# Altium project CMTestBoard.PrjPcb (part 1 of 2)
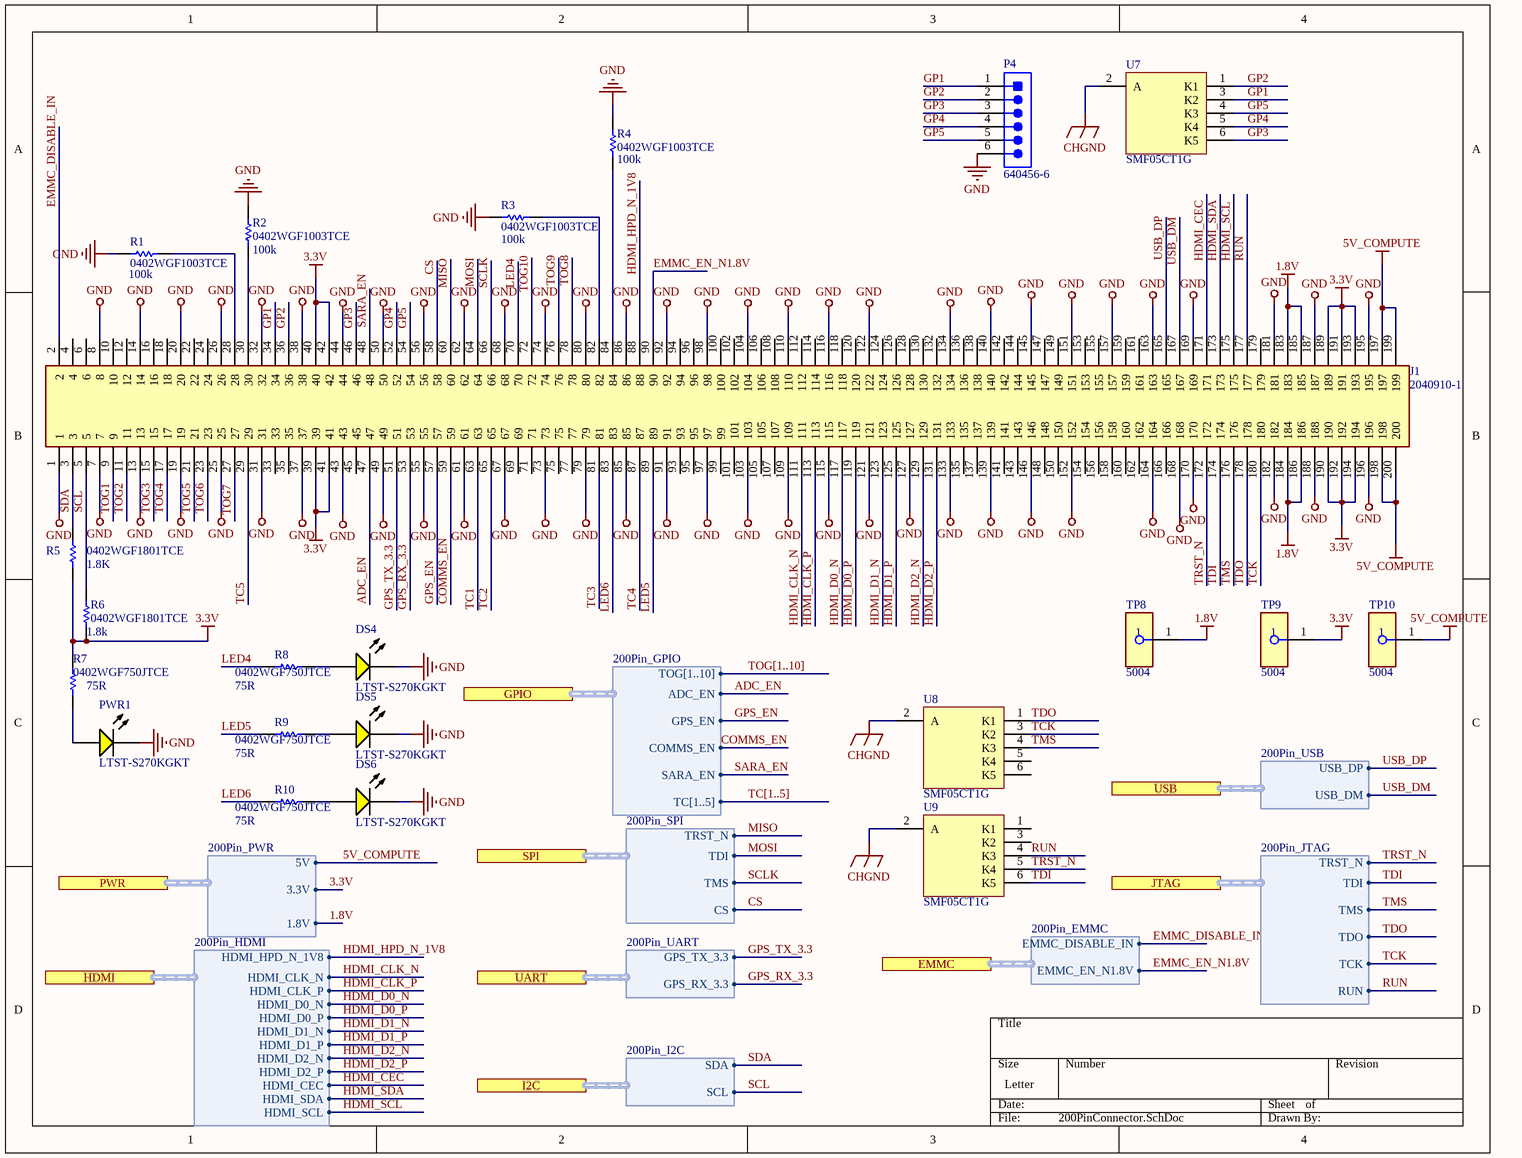
[diagram p0: 200PinConnector.SchDoc]
8 sheets, 181 parts. Net scope: hierarchical (ports join the sheet entries above them; power ports are global).
Board files: CMTestBoard.PcbDoc, CMTestBoardV2.PcbDoc
Sheets:
  200PinConnector.SchDoc
  CMTopLevel.SchDoc
    U_CMPower = 1_CMPower.SchDoc
    U_Peripherals = 4_PeripheralsV2.SchDoc
    U_200PinConnector = 3_JetsonDRAMConnector.SchDoc
    U_STM32F4 = 2_STM32F4.SchDoc
  XC95144XL.SchDoc
  EPM240T100C5N.SchDoc

## Sheet 200PinConnector.SchDoc
size Letter

### Parts
(Parts that share a designator on the sheet are numbered #1, #2 ... from top to bottom, then left to right.)
DS4  LTST-S270KGKT  [AVAG-HSMX-C190_V]
DS5  LTST-S270KGKT  [AVAG-HSMX-C190_V]
DS6  LTST-S270KGKT  [AVAG-HSMX-C190_V]
J1  2040910-1  [20409101]
P4  640456-6  [TECO-640456-6_V]
PWR1  LTST-S270KGKT  [AVAG-HSMX-C190_V]
R1  0402WGF1003TCE  [0402]
R2  0402WGF1003TCE  [0402]
R3  0402WGF1003TCE  [0402]
R4  0402WGF1003TCE  [0402]
R5  0402WGF1801TCE  value 1.8K  [0402]
R6  0402WGF1801TCE  [0402]
R7  0402WGF750JTCE  [RESC1005X40X25ML05T10]
R8  0402WGF750JTCE  [RESC1005X40X25ML05T10]
R9  0402WGF750JTCE  [RESC1005X40X25ML05T10]
R10#1  0402WGF750JTCE  [RESC1005X40X25ML05T10]
TP8#1  5004  [FP-5004-MFG]
TP9  5004  [FP-5004-MFG]
TP10  5004  [FP-5004-MFG]
U7  SMF05CT1G  [ONSC-SC70-6-419B-02_W_V]
U8  SMF05CT1G  [ONSC-SC70-6-419B-02_W_V]
U9  SMF05CT1G  [ONSC-SC70-6-419B-02_W_V]

### Ports
EMMC (harness 200Pin_EMMC), GPIO (harness 200Pin_GPIO), HDMI (harness 200Pin_HDMI), I2C (harness 200Pin_I2C), JTAG (harness 200Pin_JTAG), PWR (harness 200Pin_PWR), SPI (harness 200Pin_SPI), UART (harness 200Pin_UART), USB (harness 200Pin_USB)

### Harnesses
200Pin_USB: USB_DP, USB_DM
200Pin_JTAG: TRST_N, TDI, TMS, TDO, TCK, RUN
200Pin_HDMI: HDMI_HPD_N_1V8, HDMI_CLK_N, HDMI_CLK_P, HDMI_D0_N, HDMI_D0_P, HDMI_D1_N, HDMI_D1_P, HDMI_D2_N, HDMI_D2_P, HDMI_CEC, HDMI_SDA, HDMI_SCL
200Pin_PWR: 5V, 3.3V, 1.8V
200Pin_I2C: SDA, SCL
200Pin_UART: GPS_TX_3.3, GPS_RX_3.3
200Pin_SPI: TRST_N, TDI, TMS, CS
200Pin_EMMC: EMMC_DISABLE_IN, EMMC_EN_N1.8V
200Pin_GPIO: TOG[1..10], ADC_EN, GPS_EN, COMMS_EN, SARA_EN, TC[1..5]

### Nets
1.8V: J1.183 J1.184 J1.185 J1.186 TP8#1.1 ; port PWR.1.8V
3.3V: J1.39 J1.40 J1.41 J1.42 J1.189 J1.190 J1.191 J1.192 J1.193 J1.194 R5.1 R6.1 R7.1 TP9.1 ; port PWR.3.3V
5V_COMPUTE: J1.197 J1.198 J1.199 J1.200 TP10.1 ; port PWR.5V
CHGND: U7.2(A) U8.2(A) U9.2(A)
GND: DS4.2(K) DS5.2(K) DS6.2(K) J1.1 J1.7 J1.8 J1.13 J1.14 J1.19 J1.20 J1.25 J1.26 J1.31 J1.32 J1.37 J1.38 J1.43 J1.44 J1.49 J1.50 J1.55 J1.56 J1.61 J1.62 J1.67 J1.68 J1.73 J1.74 J1.79 J1.80 J1.85 J1.86 J1.91 J1.92 J1.97 J1.98 J1.103 J1.104 J1.109 J1.110 J1.115 J1.116 J1.121 J1.122 J1.127 J1.133 J1.134 J1.139 J1.140 J1.145 J1.146 J1.151 J1.152 J1.157 J1.163 J1.164 J1.168 J1.169 J1.170 J1.181 J1.182 J1.187 J1.188 J1.195 J1.196 P4.6 PWR1.2(K) R1.2 R2.2 R3.2 R4.2
ADC_EN: J1.47 ; port GPIO.ADC_EN
COMMS_EN: J1.59 ; port GPIO.COMMS_EN
CS: J1.58 ; port SPI.CS
EMMC_DISABLE_IN: J1.2 ; port EMMC.EMMC_DISABLE_IN
EMMC_EN_N1.8V: J1.90 ; port EMMC.EMMC_EN_N1.8V
GP1: J1.34 P4.1 U7.3(K2)
GP2: J1.36 P4.2 U7.1(K1)
GP3: J1.46 P4.3 U7.6(K5)
GP4: J1.52 P4.4 U7.5(K4)
GP5: J1.54 P4.5 U7.4(K3)
GPS_EN: J1.57 ; port GPIO.GPS_EN
GPS_RX_3.3: J1.53 ; port UART.GPS_RX_3.3
GPS_TX_3.3: J1.51 ; port UART.GPS_TX_3.3
HDMI_CEC: J1.171 ; port HDMI.HDMI_CEC
HDMI_CLK_N: J1.111 ; port HDMI.HDMI_CLK_N
HDMI_CLK_P: J1.113 ; port HDMI.HDMI_CLK_P
HDMI_D0_N: J1.117 ; port HDMI.HDMI_D0_N
HDMI_D0_P: J1.119 ; port HDMI.HDMI_D0_P
HDMI_D1_N: J1.123 ; port HDMI.HDMI_D1_N
HDMI_D1_P: J1.125 ; port HDMI.HDMI_D1_P
HDMI_D2_N: J1.129 ; port HDMI.HDMI_D2_N
HDMI_D2_P: J1.131 ; port HDMI.HDMI_D2_P
HDMI_HPD_N_1V8: J1.88 ; port HDMI.HDMI_HPD_N_1V8
HDMI_SCL: J1.175 ; port HDMI.HDMI_SCL
HDMI_SDA: J1.173 ; port HDMI.HDMI_SDA
LED4: J1.70 R8.2
LED5: J1.89 R9.2
LED6: J1.83 R10#1.2
MISO: J1.60 ; port SPI.TRST_N
MOSI: J1.64 ; port SPI.TDI
RUN: J1.177 U9.4(K3) ; port JTAG.RUN
SARA_EN: J1.48 ; port GPIO.SARA_EN
SCL: J1.5 R6.2 ; port I2C.SCL
SCLK: J1.66 ; port SPI.TMS
SDA: J1.3 R5.2 ; port I2C.SDA
TC1: J1.63
TC2: J1.65
TC3: J1.81
TC4: J1.87
TC5: J1.29
TCK: J1.180 U8.3(K2) ; port JTAG.TCK
TDI: J1.174 U9.6(K5) ; port JTAG.TDI
TDO: J1.178 U8.1(K1) ; port JTAG.TDO
TMS: J1.176 U8.4(K3) ; port JTAG.TMS
TOG1: J1.9
TOG2: J1.11
TOG3: J1.15
TOG4: J1.17
TOG5: J1.21
TOG6: J1.23
TOG7: J1.27
TOG8: J1.78
TOG9: J1.76
TOG10: J1.72
TRST_N: J1.172 U9.5(K4) ; port JTAG.TRST_N
USB_DM: J1.167 ; port USB.USB_DM
USB_DP: J1.165 ; port USB.USB_DP
NetDS4_1: DS4.1(A) R8.1
NetDS5_1: DS5.1(A) R9.1
NetDS6_1: DS6.1(A) R10#1.1
NetJ1_28: J1.28 R1.1
NetJ1_30: J1.30 R2.1
NetJ1_82: J1.82 R3.1
NetJ1_84: J1.84 R4.1
NetPWR1_1: PWR1.1(A) R7.2

Not connected (* = marked no-connect by the designer): J1 4 6 10 12 16 18 22 24 33 35 45 69 71 75 77 93 94 95 96 99 100 101 102 105 106 107 108 112 114 118 120 124 126 128 130 132 135 136 137 138 141 142 143 144 147 148 149 150 153 154 155 156 158 159 160 161 162 166 179; U8 5(K4) 6(K5); U9 1(K1) 3(K2)

### Buses and harness runs
bus TC[1..5]
bus TOG[1..10]

### Notes on the sheet
- (near R4) 100k
- (near R1) 100k
- (near R2) 100k
- (near R3) 100k
- (near R6) 1.8k
- (near R7) 75R
- (near R8) 75R
- (near R9) 75R
- (near R10#1) 75R

### Library data of the parts
DS4-DS6 PWR1 = CMP-1744-00003-1: LED Uni-Color Yellow, 65 mW, 20 mA, -40 to 85 degC, 2-Pin SMD, RoHS, Tape and Reel; Tolerance: 1%; Voltage Rating: 50 V; Power Rating: 100 mW; Case\Package: 0603; Resistance: 390 Ohm; Min Operating Temperature: -55 degC; Length: 1.6 mm; ComponentLink3Description: Package Specification; Mount: Surface Mount; PackageReference: HSMX-C190; ComponentLink2Description: Datasheet; DatasheetVersion: Mar-12; Case Code (Metric): 1608; Pins: 2; Package Quantity: 5000; ComponentLink2URL: http://docs.avagotech.com/docs/AV02-0551EN; ComponentLink1Description: Manufacturer URL; RoHSCompliant: true; Packaging: Tape and Reel; PackageDescription: 2-Pin Surface Mount Device, Body 1.6 x 0.8 mm, Height 0.9 mm; REACH SVHC: No SVHC; ComponentLink3URL: http://www.fairchildsemi.com/dwg/MA/MA03D.pdf; Voltage Rating (DC): 50 V; Width: 0.8 mm; ComponentLink1URL: http://www.avagotech.com/; Max Operating Temperature: 155 degC; Case Code (Imperial): 0603; Height: 0.45 mm
J1 = 2040910-1: 200 Pin Connector; Manufacturer_Name: TE Connectivity; Datasheet Link: https://www.arrow.com/en/products/2040910-1/te-connectivity; Height: 15mm; Manufacturer_Part_Number: 2040910-1; Arrow Part Number: 2040910-1; Arrow Price/Stock: https://www.arrow.com/en/products/2040910-1/te-connectivity; Mouser Part Number: 571-2040910-1; Mouser Price/Stock: https://www.mouser.co.uk/ProductDetail/TE-Connectivity/2040910-1?qs=kAqyOuzYGe9tF8FZbDgYRA%3D%3D
P4 = CMP-2000-05661-1: Male Header, Pitch 2.54 mm, 1 x 6 Position, Height 10.03 mm, Tail Length 3.56 mm, -55 to 105 degC, Bulk; Manufacturer: TE Connectivity; Contact Centerline Spacing: 0.100 / in.; Number of Contacts: 6; Current, Rating: 5 / A; Agency Approvals: CSA,UL; Material, Contact: CopperAlloy; Mounting Hole Size: 0.04 / "; Brand/Series: MTA-100Series; Pin Spacing: 0.1 / "; Mount Angle: Vertical; Contact Termination Area Plating: Tin; Angle: Straight; Primary Type: InterconnectSystem; Standards: RoHSCompliant,ELVCompliant,UL94V-0; Temperature, Operating: -55to+105 / °C; Material, Housing: Polyester; Special Features: Pinstrip; Color, Housing: White; Connector Type: MTA-100; Voltage, Rating: 250 / V; Termination: Solder; Package Reference: 640456-6; Size, Post: 0.025 / in.; Color: White; Datasheet URL: https://datasheet.ciiva.com/25618/0900766b80eb7fdd-25618163.pdf; Manufacturer URL: http://www.te.com/; Mounting Type: PCMount; Length, Pin: 0.14 / "; Type: PCBPlug; Length, Overall: 0.6 / "; Mounting Technology: ThroughHole; Number of Rows: 1; Contact Shape: Square; Contact Mating Area Plating: Tin; Datasheet Version: Rev. W, 05/2005; Number of Positions: 6; Package Description: Male Header, Pitch 2.54 mm, 1 x 6 Position, Height 10.03 mm, Tail Length 3.56 mm; Contact Plating: Tin; Length, Terminal Post: 0.14 / in.; Flammability Rating: UL94V-0
R1-R4 = Res1: 100k 0402; Published: 8-Jun-2000; LatestRevisionDate: 17-Jul-2002; LatestRevisionNote: Re-released for DXP Platform.; PackageReference: AXIAL-0.3; Publisher: Altium Limited; PackageDescription: Axial Device, Thru-Hole; 2 Leads; 0.3 in Pin Spacing
  R1: Case Code (Imperial): 0402
R5 R6 = Res1: 1.8k 0402; Published: 8-Jun-2000; LatestRevisionDate: 17-Jul-2002; LatestRevisionNote: Re-released for DXP Platform.; PackageReference: AXIAL-0.3; Publisher: Altium Limited; PackageDescription: Axial Device, Thru-Hole; 2 Leads; 0.3 in Pin Spacing
R7-R9 R10#1 = CMP-2002-07344-1: 75R 0402; Part Number: RC0402FR-07100RL; Manufacturer: Yageo / Phycomp
TP8#1 TP9 TP10 = CMP-2000-05575-2: PC TEST POINT MINIATURE YELLOW; Manufacturer: Keystone; Number Of Contacts: 1; Is Female: yes; Device Class L1: Connectors; Manufacturer Part Number: 5004; Digikey Description: PC TEST POINT MINIATURE YELLOW; ComponentLink2URL: https://www.keyelco.com/product-pdf.cfm?p=1313; Lead Free: Yes; ComponentLink2Description: Datasheet; Category: Conn; Height: 4.72mm; Octopart: https://octopart.com/5004-keystone-28591; Mouser Description: TEST POINT PC MINI .040"D YELLOW; Device Class L3: unset; Contact Material: Silver; Package: 5004; Automotive: No; Device Class L2: unset; RoHS: TRUE
U7-U9 = CMP-1061-00155-1: 5-Line Transient Voltage Suppressor Array, 6-Pin SC70, Pb-Free, Tape and Reel; Manufacturer: On Semiconductor; PPK Max (W): 100; Direction: Unidirectional; IR Max (uA): 5; PackageDescription: 6-Pin Small Outline Transistor, Body 2 x 1.25 mm, Pitch 0.65 mm; PackageReference: SC70-6-419B-02_W; ComponentLink2Description: Datasheet; Mounting Technology: Surface Mount; Packing: Tape and Reel; DatasheetVersion: Rev. 4; ComponentLink1Description: Manufacturer URL; ComponentLink2URL: http://www.onsemi.com/pub_link/Collateral/SMF05C-D.PDF; ComponentLink3Description: Package Specification; ComponentLink1URL: http://www.onsemi.com/; ComponentLink3URL: http://www.onsemi.com/pub_link/Collateral/SMF05C-D.PDF; PackageVersion: Rev. W; PartNumber: SMF05CT1G; RoHS: Pb-Free

## Sheet CMTopLevel.SchDoc
size Letter
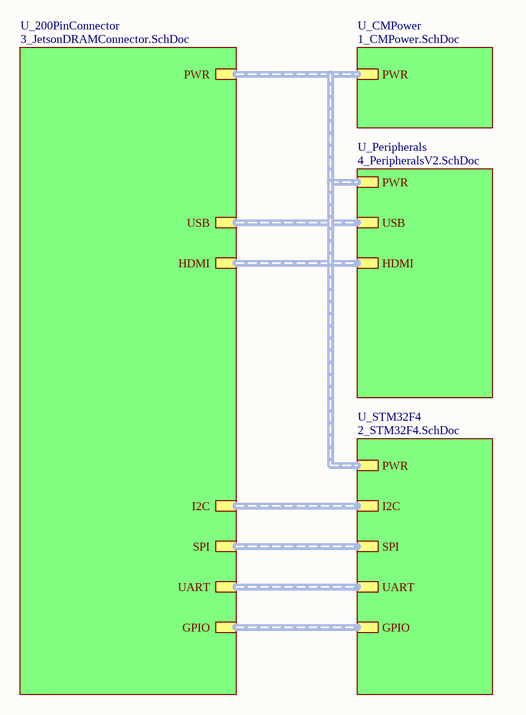
[diagram p1: CMTopLevel.SchDoc]

### Sub-sheets
U_200PinConnector = 3_JetsonDRAMConnector.SchDoc: PWR (harness SODIMM_MO-224_POWER), USB (harness SODIMM_MO-224_POWER), HDMI (harness SODIMM_MO-224_POWER), I2C (harness SODIMM_MO-224_POWER), SPI (harness SODIMM_MO-224_POWER), UART (harness SODIMM_MO-224_POWER), GPIO (harness SODIMM_MO-224_POWER)
U_CMPower = 1_CMPower.SchDoc: PWR (harness SODIMM_MO-224_POWER)
U_Peripherals = 4_PeripheralsV2.SchDoc: USB (harness SODIMM_MO-224_POWER), HDMI (harness SODIMM_MO-224_POWER), PWR (harness SODIMM_MO-224_POWER)
U_STM32F4 = 2_STM32F4.SchDoc: PWR (harness SODIMM_MO-224_POWER), I2C (harness SODIMM_MO-224_POWER), UART (harness SODIMM_MO-224_POWER), SPI (harness SODIMM_MO-224_POWER), GPIO (harness SODIMM_MO-224_POWER)

### Buses and harness runs
harness sheet U_200PinConnector/GPIO = sheet U_STM32F4/GPIO
harness sheet U_200PinConnector/HDMI = sheet U_Peripherals/HDMI
harness sheet U_200PinConnector/I2C = sheet U_STM32F4/I2C
harness sheet U_200PinConnector/PWR = sheet U_CMPower/PWR = sheet U_Peripherals/PWR = sheet U_STM32F4/PWR
harness sheet U_200PinConnector/SPI = sheet U_STM32F4/SPI
harness sheet U_200PinConnector/UART = sheet U_STM32F4/UART
harness sheet U_200PinConnector/USB = sheet U_Peripherals/USB

## Sheet 1_CMPower.SchDoc
size Letter
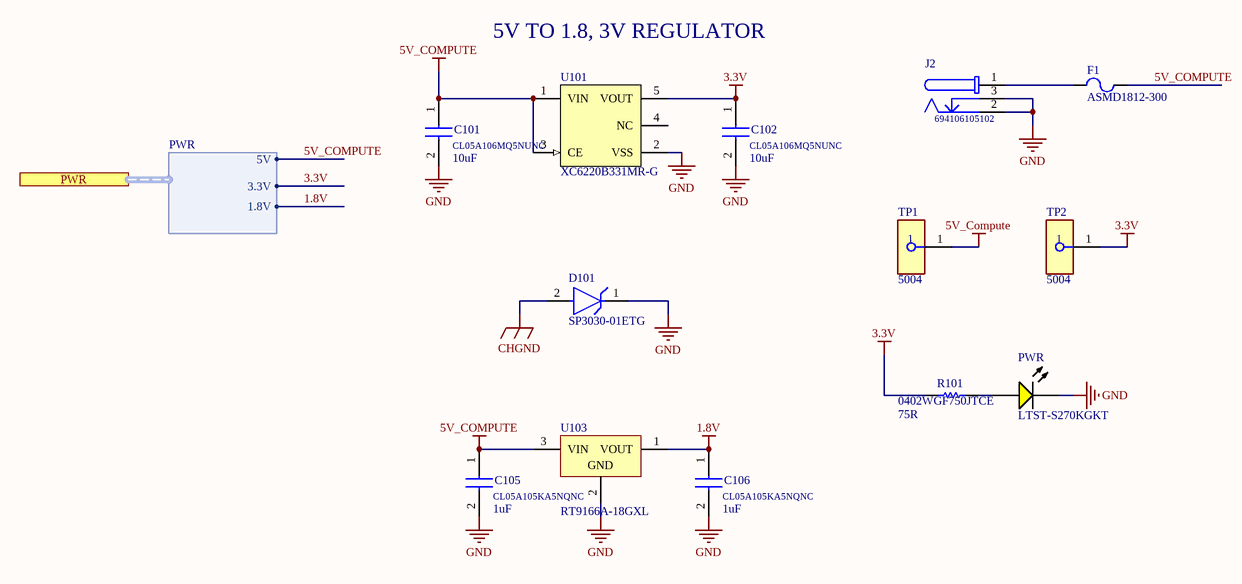
[diagram p2: 1_CMPower.SchDoc]

### Parts
C101  CL05A106MQ5NUNC  value 10uF  [CAPC1005X55N]
C102  CL05A106MQ5NUNC  value 10uF  [CAPC1005X55N]
C105  CL05A105KA5NQNC  value 1uF  [CAPC1005X55N]
C106  CL05A105KA5NQNC  value 1uF  [CAPC1005X55N]
D101  SP3030-01ETG  [FP-SP3030-MFG]
F1  ASMD1812-300  [LFUS-FUSE1812-71_V]
J2  694106105102  [694106105102]
PWR  LTST-S270KGKT  [AVAG-HSMX-C190_V]
R101  0402WGF750JTCE  [RESC1005X40X25ML05T10]
TP1  5004  [FP-5004-MFG]
TP2  5004  [FP-5004-MFG]
U101  XC6220B331MR-G  [TORX-SOT-25-5_M]
U103  RT9166A-18GXL  [SOT-89_N]

### Ports
PWR (harness PWR)

### Harnesses
PWR: 5V, 3.3V, 1.8V

### Nets
1.8V: C106.1 U103.1(VOUT) ; port PWR.1.8V
3.3V: C102.1 R101.2 TP2.1 U101.5(VOUT) ; port PWR.3.3V
5V_COMPUTE: C101.1 C105.1 F1.2 TP1.1 U101.1(VIN) U101.3(CE) U103.3(VIN) ; port PWR.5V
CHGND: D101.2(A)
GND: C101.2 C102.2 C105.2 C106.2 D101.1(C) J2.2 J2.3 PWR.2(K) U101.2(VSS) U103.2(GND)
NetF1_1: F1.1 J2.1
NetPWR_1: PWR.1(A) R101.1

Not connected (* = marked no-connect by the designer): U101 4(NC)

### Notes on the sheet
- 5V TO 1.8, 3V REGULATOR
- (near R101) 75R

### Library data of the parts
C101 C102 = C0402C560K5RACTU: 10uF 0402; Manufacturer_Name: Kemet; Datasheet Link: https://content.kemet.com/datasheets/KEM_C1002_X7R_SMD.pdf; Height: 0.55mm; Manufacturer_Part_Number: C0402C560K5RACTU; Arrow Part Number: C0402C560K5RACTU; Mouser Part Number: 80-C0402C560K5RACTU; Mouser Price/Stock: https://www.mouser.co.uk/ProductDetail/KEMET/C0402C560K5RACTU?qs=gt1LBUVyoHmQZW5v3ySgNQ%3D%3D
C105 C106 = C0402C560K5RACTU: 1uF 0402; Manufacturer_Name: Kemet; Datasheet Link: https://content.kemet.com/datasheets/KEM_C1002_X7R_SMD.pdf; Height: 0.55mm; Manufacturer_Part_Number: C0402C560K5RACTU; Arrow Part Number: C0402C560K5RACTU; Mouser Part Number: 80-C0402C560K5RACTU; Mouser Price/Stock: https://www.mouser.co.uk/ProductDetail/KEMET/C0402C560K5RACTU?qs=gt1LBUVyoHmQZW5v3ySgNQ%3D%3D
D101 = CMP-08607-000070-1: TVS DIODE 5V 10V SOD882; Manufacturer: Littelfuse; Max Junction Temp: +150°C; Automotive Grade: Grade 1; Direction: Unidirectional; Peak Pulse Current: 3A; Capacitance: 0.5pF; Value: 0.5pF; Number Of Channels: 1; Manufacturer Part Number: SP3030-01ETG; Temperature Range Low: -40°C; Lead Free: Yes; Package: SP3030; Device Class L2: TVS Diodes; Height: 0.6mm; ComponentLink2URL: https://www.littelfuse.com/~/media/electronics/datasheets/tvs_diode_arrays/littelfuse_tvs_diode_array_sp3030_datasheet.pdf.pdf; Device Class L3: unset; Category: Diode; Reverse Standoff Voltage: 5V; RoHS: TRUE; Digikey Description: TVS DIODE 5V 10V SOD882; Octopart: https://octopart.com/sp3030-01etg-littelfuse-29687287; ComponentLink2Description: Datasheet; Device Class L1: Circuit Protection; Automotive: Yes; Temperature: -40°C to +125°C; Temperature Range High: +125°C; Clamping Voltage: 10V; Mouser Description: TVS Diodes / ESD Suppressors 5V 1uA 22kV UNIDIRECTIONAL
F1 = CMP-0257-00001-1: Resettable PTC, 1812, 3 A Ihold, 5 A Itrip, 8V max; PartNumber: 1812L150ZR; Itrip: 3 A; Vmax: 8 Vdc; Ihold: 1.5 A; Imax: 100 A; PackageReference: FUSE1812-71; ComponentLink1Description: Manufacturer URL; DatasheetVersion: 6/2012; ComponentLink2URL: http://www.littelfuse.com/products/resettable-ptcs/surface-mount/1812l/~/media/Electronics_Technical/Datasheets/Resettable_PTCs/Littelfuse_PTC_1812L_Datasheet.pdf; PackageVersion: 6/2012; PackageDescription: 2-Pin SMT Fuse, 4.55 x 3.24 mm Body; ComponentLink1URL: http://www.littelfuse.com/; ComponentLink2Description: Datasheet
J2 = CMP-1502-00176-1: DC Power Jack Connector with Pegs WR-DC, Male, Right Angled, SMT, 5 A, 24 V; Manufacturer: Wurth Elektronik; Plug Outer Diameter: 5.5mm; Opening Diameter: 6.4mm; Plug Inner Diameter: 2.05mm; Rated Current: 5A; Working Voltage: 24V; Publisher: WurthElektronik; Operating Temperature: -40to85degC; Packaging: TapeandReel; Part Number: 694106105102; Manufacturer URL: http://www.we-online.de; Mounting Technology: SMT; Gender: Male; Package Reference: 694106105102; Datasheet URL: http://katalog.we-online.de/em/datasheet/6941xx105102.pdf; Orientation: RightAngled
PWR = CMP-1744-00003-1: as DS4 on sheet 200PinConnector; Min Operating Temperature: -55 degC; Length: 1.6 mm; ComponentLink3Description: Package Specification; Mount: Surface Mount; PackageReference: HSMX-C190; ComponentLink2Description: Datasheet; DatasheetVersion: Mar-12; Case Code (Metric): 1608; Pins: 2; Package Quantity: 5000; ComponentLink2URL: http://docs.avagotech.com/docs/AV02-0551EN; ComponentLink1Description: Manufacturer URL; RoHSCompliant: true; Packaging: Tape and Reel; PackageDescription: 2-Pin Surface Mount Device, Body 1.6 x 0.8 mm, Height 0.9 mm; REACH SVHC: No SVHC; ComponentLink3URL: http://www.fairchildsemi.com/dwg/MA/MA03D.pdf; Voltage Rating (DC): 50 V; Width: 0.8 mm; ComponentLink1URL: http://www.avagotech.com/; Max Operating Temperature: 155 degC; Case Code (Imperial): 0603; Height: 0.45 mm
R101 = CMP-2002-07344-1: as R7 on sheet 200PinConnector
TP1 TP2 = CMP-2000-05575-2: as TP8#1 on sheet 200PinConnector; Device Class L1: Connectors; Manufacturer Part Number: 5004; Digikey Description: PC TEST POINT MINIATURE YELLOW; ComponentLink2URL: https://www.keyelco.com/product-pdf.cfm?p=1313; Lead Free: Yes; ComponentLink2Description: Datasheet; Category: Conn; Height: 4.72mm; Octopart: https://octopart.com/5004-keystone-28591; Mouser Description: TEST POINT PC MINI .040"D YELLOW; Device Class L3: unset; Contact Material: Silver; Package: 5004; Automotive: No; Device Class L2: unset; RoHS: TRUE
U101 = CMP-0599-00001-2: 1A LDO Voltage Regulator with CL discharge, 3.3 V, 1000 mA, -45 to 85 degC, 5-Pin SOT-25, RoHS, Reel; Manufacturer: Torex; Output Voltage: 3.3 V; Maximum Output Current: 1000 mA; ComponentLink1Description: Manufacturer URL; ComponentLink2URL: http://www.torex.co.jp/english/products/voltage_regulators/data/XC6220.pdf; DatasheetVersion: ETR0341-010a; ComponentLink1URL: http://www.torex.co.jp/; Mounting Technology: Surface Mount; Operating Ambient Temperature: -40 to 85 degC; PackageReference: SOT-25-5; PackageDescription: 5-Pin Small Out-Line Transistor, Body 2.9 x 1.65 mm, Pitch 0.95 mm; PartNumber: XC6220B331MR-G; RoHS: TRUE; Packing: Reel; ComponentLink2Description: Datasheet
U103 = CMP-0244-00406-1: Positive Voltage Regulator, 5V, 4-Pin SOT-89, Tape and Reel; PackageVersion: 2011; DatasheetVersion: 1/02/2011; PackageDescription: 3-Pin SOT-89 Package 1.5 mm Pitch, 4.1 mm Lead Span; PackageReference: SOT-89; ComponentLink2Description: Datasheet; ComponentLink1URL: http://www.st.com; ComponentLink1Description: Manufacturer URL; ComponentLink2URL: http://www.st.com/internet/com/TECHNICAL_RESOURCES/TECHNICAL_LITERATURE/DATASHEET/CD00000446.pdf

## Sheet 4_PeripheralsV2.SchDoc
size Letter
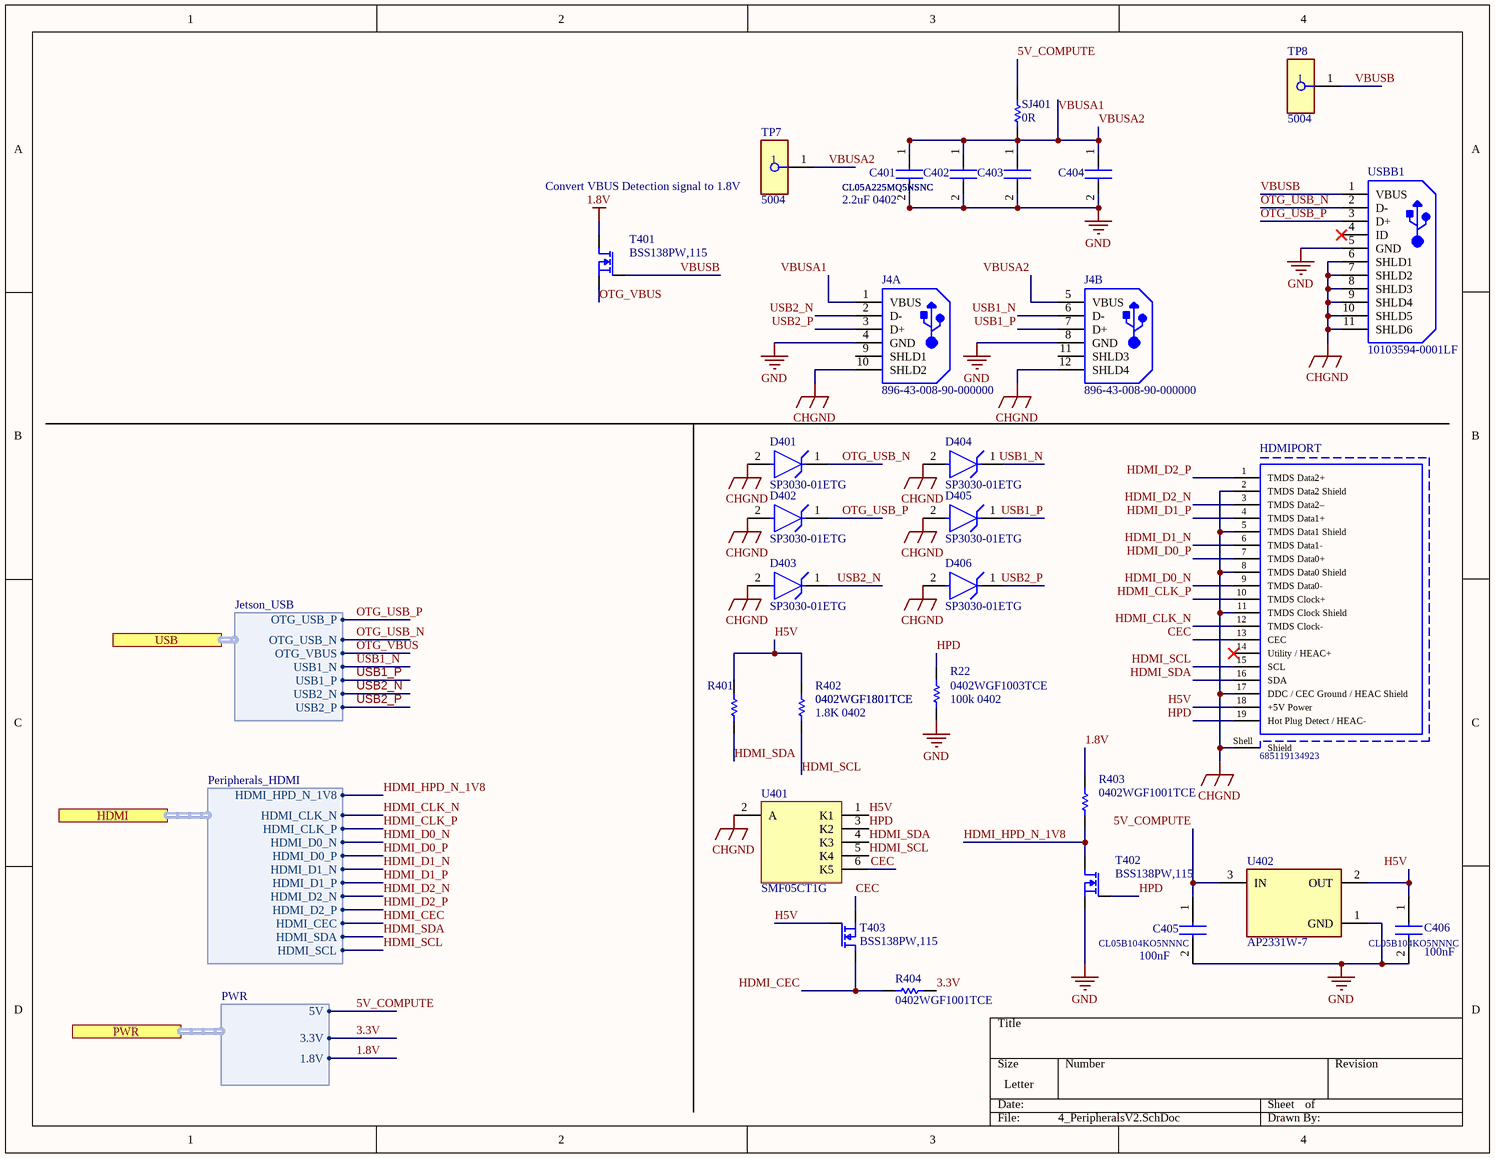
[diagram p3: 4_PeripheralsV2.SchDoc]

### Parts
(Parts that share a designator on the sheet are numbered #1, #2 ... from top to bottom, then left to right.)
C401  CL05A225MQ5NSNC  [CAPC1005X55N]
C402  CL05A225MQ5NSNC  [CAPC1005X55N]
C403  CL05A225MQ5NSNC  [CAPC1005X55N]
C404  CL05A225MQ5NSNC  [CAPC1005X55N]
C405  CL05B104KO5NNNC  value 100nF  [CAPC1005X55N]
C406  CL05B104KO5NNNC  value 100nF  [CAPC1005X55N]
D401  SP3030-01ETG  [FP-SP3030-MFG]
D402  SP3030-01ETG  [FP-SP3030-MFG]
D403  SP3030-01ETG  [FP-SP3030-MFG]
D404  SP3030-01ETG  [FP-SP3030-MFG]
D405  SP3030-01ETG  [FP-SP3030-MFG]
D406  SP3030-01ETG  [FP-SP3030-MFG]
HDMIPORT  685119134923  [685119134923]
J4  896-43-008-90-000000  [MILL-896-43-008-90-000000_V]  (parts A,B of 2)
R22  0402WGF1003TCE  [0402]
R401  0402WGF1801TCE  [0402]
R402  0402WGF1801TCE  value 1.8K 0402  [0402]
R403  0402WGF1001TCE  [0402]
R404  0402WGF1001TCE  [0402]
SJ401  0R  [J1-0603]
T401  BSS138PW,115  [SC70-3]
T402  BSS138PW,115  [SC70-3]
T403  BSS138PW,115  [SC70-3]
TP7#1  5004  [FP-5004-MFG]
TP8#2  5004  [FP-5004-MFG]
U401  SMF05CT1G  [ONSC-SC70-6-419B-02_W_V]
U402  AP2331W-7  [FP-SC59-IPC_B]
USBB1  10103594-0001LF  [FCI-10103594-0001LF_V]

### Ports
HDMI (harness Peripherals_HDMI), PWR (harness PWR), USB (harness Jetson_USB)

### Harnesses
Peripherals_HDMI: HDMI_HPD_N_1V8, HDMI_CLK_N, HDMI_CLK_P, HDMI_D0_N, HDMI_D0_P, HDMI_D1_N, HDMI_D1_P, HDMI_D2_N, HDMI_D2_P, HDMI_CEC, HDMI_SDA, HDMI_SCL
PWR: 5V, 3.3V, 1.8V
Jetson_USB: OTG_USB_P, OTG_USB_N, USB1_N, USB1_P, USB2_N, USB2_P, OTG_VBUS

### Nets
1.8V: R403.1 T401.3(D) ; port PWR.1.8V
3.3V: R404.2 ; port PWR.3.3V
5V_COMPUTE: C405.1 SJ401.2 U402.3(IN) ; port PWR.5V
CHGND: D401.2(A) D402.2(A) D403.2(A) D404.2(A) D405.2(A) D406.2(A) HDMIPORT.2(TMDS_Data2_Shield) HDMIPORT.5(TMDS_Data1_Shield) HDMIPORT.8(TMDS_Data0_Shield) HDMIPORT.11(TMDS_Clock_Shield) HDMIPORT.17(DDC_/_CEC_Ground_/_HEAC_Shield) HDMIPORT.Shell(Shield) J4.10(SHLD2) J4.12(SHLD4) U401.2(A) USBB1.6(SHLD1) USBB1.7(SHLD2) USBB1.8(SHLD3) USBB1.9(SHLD4) USBB1.10(SHLD5) USBB1.11(SHLD6)
GND: C401.2 C402.2 C403.2 C404.2 C405.2 C406.2 J4.4(GND) J4.8(GND) R22.2 T402.2(S) U402.1(GND) USBB1.5(GND)
CEC: HDMIPORT.13(CEC) T403.2(S) U401.6(K5)
H5V: C406.1 HDMIPORT.18(+5V_Power) R401.2 R402.2 T403.1(G) U401.1(K1) U402.2(OUT)
HDMI_CEC: R404.1 T403.3(D) ; port HDMI.HDMI_CEC
HDMI_CLK_N: HDMIPORT.12(TMDS_Clock-) ; port HDMI.HDMI_CLK_N
HDMI_CLK_P: HDMIPORT.10(TMDS_Clock+) ; port HDMI.HDMI_CLK_P
HDMI_D0_N: HDMIPORT.9(TMDS_Data0-) ; port HDMI.HDMI_D0_N
HDMI_D0_P: HDMIPORT.7(TMDS_Data0+) ; port HDMI.HDMI_D0_P
HDMI_D1_N: HDMIPORT.6(TMDS_Data1-) ; port HDMI.HDMI_D1_N
HDMI_D1_P: HDMIPORT.4(TMDS_Data1+) ; port HDMI.HDMI_D1_P
HDMI_D2_N: HDMIPORT.3(TMDS_Data2–) ; port HDMI.HDMI_D2_N
HDMI_D2_P: HDMIPORT.1(TMDS_Data2+) ; port HDMI.HDMI_D2_P
HDMI_HPD_N_1V8: R403.2 T402.3(D) ; port HDMI.HDMI_HPD_N_1V8
HDMI_SCL: HDMIPORT.15(SCL) R402.1 U401.5(K4) ; port HDMI.HDMI_SCL
HDMI_SDA: HDMIPORT.16(SDA) R401.1 U401.4(K3) ; port HDMI.HDMI_SDA
HPD: HDMIPORT.19(Hot_Plug_Detect_/_HEAC-) R22.1 T402.1(G) U401.3(K2)
OTG_USB_N: D401.1(C) USBB1.2(D-) ; port USB.OTG_USB_N
OTG_USB_P: D402.1(C) USBB1.3(D+) ; port USB.OTG_USB_P
OTG_VBUS: T401.2(S) ; port USB.OTG_VBUS
USB1_N: D404.1(C) J4.6(D-) ; port USB.USB1_N
USB1_P: D405.1(C) J4.7(D+) ; port USB.USB1_P
USB2_N: D403.1(C) J4.2(D-) ; port USB.USB2_N
USB2_P: D406.1(C) J4.3(D+) ; port USB.USB2_P
VBUSA1: C401.1 C402.1 C403.1 C404.1 J4.1(VBUS) J4.5(VBUS) SJ401.1 TP7#1.1  [also labelled VBUSA2]
VBUSB: T401.1(G) TP8#2.1 USBB1.1(VBUS)

Not connected (* = marked no-connect by the designer): HDMIPORT 14(Utility_/_HEAC+)*; J4 9(SHLD1) 11(SHLD3); USBB1 4(ID)*

### Notes on the sheet
- (near TP7#1) Convert VBUS Detection signal to 1.8V
- (near C401) 2.2uF 0402
- (near R22) 100k 0402

### Library data of the parts
C401-C404 = C0402C560K5RACTU: 2.2uF 0402; Manufacturer_Name: Kemet; Datasheet Link: https://content.kemet.com/datasheets/KEM_C1002_X7R_SMD.pdf; Height: 0.55mm; Manufacturer_Part_Number: C0402C560K5RACTU; Arrow Part Number: C0402C560K5RACTU; Mouser Part Number: 80-C0402C560K5RACTU; Mouser Price/Stock: https://www.mouser.co.uk/ProductDetail/KEMET/C0402C560K5RACTU?qs=gt1LBUVyoHmQZW5v3ySgNQ%3D%3D
C405 C406 = C0402C560K5RACTU: 100nF 0402; Manufacturer_Name: Kemet; Datasheet Link: https://content.kemet.com/datasheets/KEM_C1002_X7R_SMD.pdf; Height: 0.55mm; Manufacturer_Part_Number: C0402C560K5RACTU; Arrow Part Number: C0402C560K5RACTU; Mouser Part Number: 80-C0402C560K5RACTU; Mouser Price/Stock: https://www.mouser.co.uk/ProductDetail/KEMET/C0402C560K5RACTU?qs=gt1LBUVyoHmQZW5v3ySgNQ%3D%3D
D401-D406 = CMP-08607-000070-1: as D101 on sheet 1_CMPower; Manufacturer Part Number: SP3030-01ETG; Temperature Range Low: -40°C; Lead Free: Yes; Package: SP3030; Device Class L2: TVS Diodes; Height: 0.6mm; ComponentLink2URL: https://www.littelfuse.com/~/media/electronics/datasheets/tvs_diode_arrays/littelfuse_tvs_diode_array_sp3030_datasheet.pdf.pdf; Device Class L3: unset; Category: Diode; Reverse Standoff Voltage: 5V; RoHS: TRUE; Digikey Description: TVS DIODE 5V 10V SOD882; Octopart: https://octopart.com/sp3030-01etg-littelfuse-29687287; ComponentLink2Description: Datasheet; Device Class L1: Circuit Protection; Automotive: Yes; Temperature: -40°C to +125°C; Temperature Range High: +125°C; Clamping Voltage: 10V; Mouser Description: TVS Diodes / ESD Suppressors 5V 1uA 22kV UNIDIRECTIONAL
HDMIPORT = CMP-1502-00169-1: HDMI Type A Receptacle WR-HDMI, Horizontal, SMT; Manufacturer: Wurth Elektronik; Contact Resistance: 30mOhm; Working Voltage: 40VDC; Rated Current: 0.5A; Publisher: WurthElektronik; Datasheet URL: https://katalog.we-online.de/em/datasheet/685119134923.pdf; Gender: Receptacle; Manufacturer URL: http://www.we-online.de; Orientation: Horizontal; Mounting Technology: SMT; Part Number: 685119134923; Packaging: TapeandReel; Package Reference: 685119134923; Operating Temperature: -20to85degC; Connector Type: HDMITypeA; LCSC Part #: *
J4 = CMP-2000-05704-1: Double Row Type A USB Socket, USB 2.0, 8 Position, RoHS, Tray; Mounting Angle: Right; Insulation Resistance: 1000MOhms; Brand: Mill-Max; Number of Positions / Contacts: 4; Gender: Female; Number of Ports: 1; Connector Type: USBTypeAReceptacle; Datasheet URL: https://www.mill-max.com/products/datasheet/sockets/896-43-008-90-000000; Package Description: 8-Pin Through Hole Device, Body 16.967 x 14.503 mm; Mounting Technology: ThroughHole; Factory Pack Quantity: 120; Manufacturer URL: https://www.mill-max.com/; Package Reference: 896-43-008-90-000000; Contact Plating: Gold; Termination Style: SMD; Datasheet Version: 09/2016; Standard: USB; Manufacturer: Mill-Max; Product: USBTypeAConnectors; Number of Contacts: 4; Contact Material: CopperAlloy; RoHS: Details; Mounting Style: SMD/SMT; Number of Positions: 4; Product Category: USBConnectors; Packaging: Tube
R22 = Res1: 100k 0402; Published: 8-Jun-2000; LatestRevisionDate: 17-Jul-2002; LatestRevisionNote: Re-released for DXP Platform.; PackageReference: AXIAL-0.3; Publisher: Altium Limited; PackageDescription: Axial Device, Thru-Hole; 2 Leads; 0.3 in Pin Spacing
R401 R402 = Res1: 1.8k 0402; Published: 8-Jun-2000; LatestRevisionDate: 17-Jul-2002; LatestRevisionNote: Re-released for DXP Platform.; PackageReference: AXIAL-0.3; Publisher: Altium Limited; PackageDescription: Axial Device, Thru-Hole; 2 Leads; 0.3 in Pin Spacing
R403 R404 = Res1: 1k 0402; Published: 8-Jun-2000; LatestRevisionDate: 17-Jul-2002; LatestRevisionNote: Re-released for DXP Platform.; PackageReference: AXIAL-0.3; Publisher: Altium Limited; PackageDescription: Axial Device, Thru-Hole; 2 Leads; 0.3 in Pin Spacing
SJ401 = Res1: Resistor; Published: 8-Jun-2000; LatestRevisionDate: 17-Jul-2002; LatestRevisionNote: Re-released for DXP Platform.; PackageReference: AXIAL-0.3; Publisher: Altium Limited; PackageDescription: Axial Device, Thru-Hole; 2 Leads; 0.3 in Pin Spacing; Value: 0R; LCSC Part #: C21189
T401-T403 = NMOS: MOSFET, N CH, 60V, 0.2A; Manufacturer: NXP; Value: BSS138PW,115; PartNumber: BSS138PW,115; MPN: BSS138PW,115
TP7#1 TP8#2 = CMP-2000-05575-2: as TP8#1 on sheet 200PinConnector; Device Class L1: Connectors; Manufacturer Part Number: 5004; Digikey Description: PC TEST POINT MINIATURE YELLOW; ComponentLink2URL: https://www.keyelco.com/product-pdf.cfm?p=1313; Lead Free: Yes; ComponentLink2Description: Datasheet; Category: Conn; Height: 4.72mm; Octopart: https://octopart.com/5004-keystone-28591; Mouser Description: TEST POINT PC MINI .040"D YELLOW; Device Class L3: unset; Contact Material: Silver; Package: 5004; Automotive: No; Device Class L2: unset; RoHS: TRUE
U401 = CMP-1061-00155-1: as U7 on sheet 200PinConnector; PackageDescription: 6-Pin Small Outline Transistor, Body 2 x 1.25 mm, Pitch 0.65 mm; PackageReference: SC70-6-419B-02_W; ComponentLink2Description: Datasheet; Mounting Technology: Surface Mount; Packing: Tape and Reel; DatasheetVersion: Rev. 4; ComponentLink1Description: Manufacturer URL; ComponentLink2URL: http://www.onsemi.com/pub_link/Collateral/SMF05C-D.PDF; ComponentLink3Description: Package Specification; ComponentLink1URL: http://www.onsemi.com/; ComponentLink3URL: http://www.onsemi.com/pub_link/Collateral/SMF05C-D.PDF; PackageVersion: Rev. W; PartNumber: SMF05CT1G; RoHS: Pb-Free
U402 = CMP-12752-000002-1: LOAD SWITCH SC59; Min Supply Voltage: 2.7V; Interface: On/Off; Turn-On Delay Time: 700us; Voltage: 5.2V; Current: 200mA; Output Configuration: High Side; Number of Outputs: 1; On-State Resistance: 350mR; Fault Protection: Over Temperature; Min Operating Temperature: -40°C; Number of Pins: 59; Max Operating Temperature: 85°C; Height: 1.3mm; Package Quantity: 3000; REACH SVHC: No SVHC; Radiation Hardening: No; Output Current: 200mA; Max Supply Voltage: 5.2V; Max Output Current: 200mA; Case/Package: TO-236-3; Width: 1.7mm; Mount: Surface Mount; Packaging: Tape and Reel; Length: 3.1mm; LCSC Part #: *
USBB1 = CMP-1698-00007-1: Micro USB 2.0 B Receptacle, -55 to 85 degC, 5-Pin SMD, RoHS, Tape and Reel; Type (Resistor): Thick Film; Case\Package: 0603; Resistance: 4.7 kohm; Tolerance: 1%; Voltage Rating: 75 V; Power Rating: 100 mW; Case Code (Imperial): 0603; Case Code (Metric): 1608; REACH SVHC: Unknown; ComponentLink1URL: http://portal.fciconnect.com/; Package Quantity: 5000; RoHSCompliant: true; Max Operating Temperature: 155 degC; Min Operating Temperature: -55 degC; Mount: Surface Mount; Weight: 7.1E-05 oz; Length: 1.55 mm; PackageDescription: 5-Pin Surface Mount Device, Body 8.04 x 5.62 mm; Pins: 2; Height: 0.45 mm; ComponentLink2Description: Datasheet; ComponentLink2URL: http://portal.fciconnect.com/Comergent//fci/drawing/10103594.pdf; PackageReference: FCI-10103594-0001LF; DatasheetVersion: Rev. A, 06/2010; Width: 0.85 mm; Packaging: Tape and Reel; ComponentLink1Description: Manufacturer URL; LCSC Part #: *

## Sheet 3_JetsonDRAMConnector.SchDoc
size 381 x 241 mm
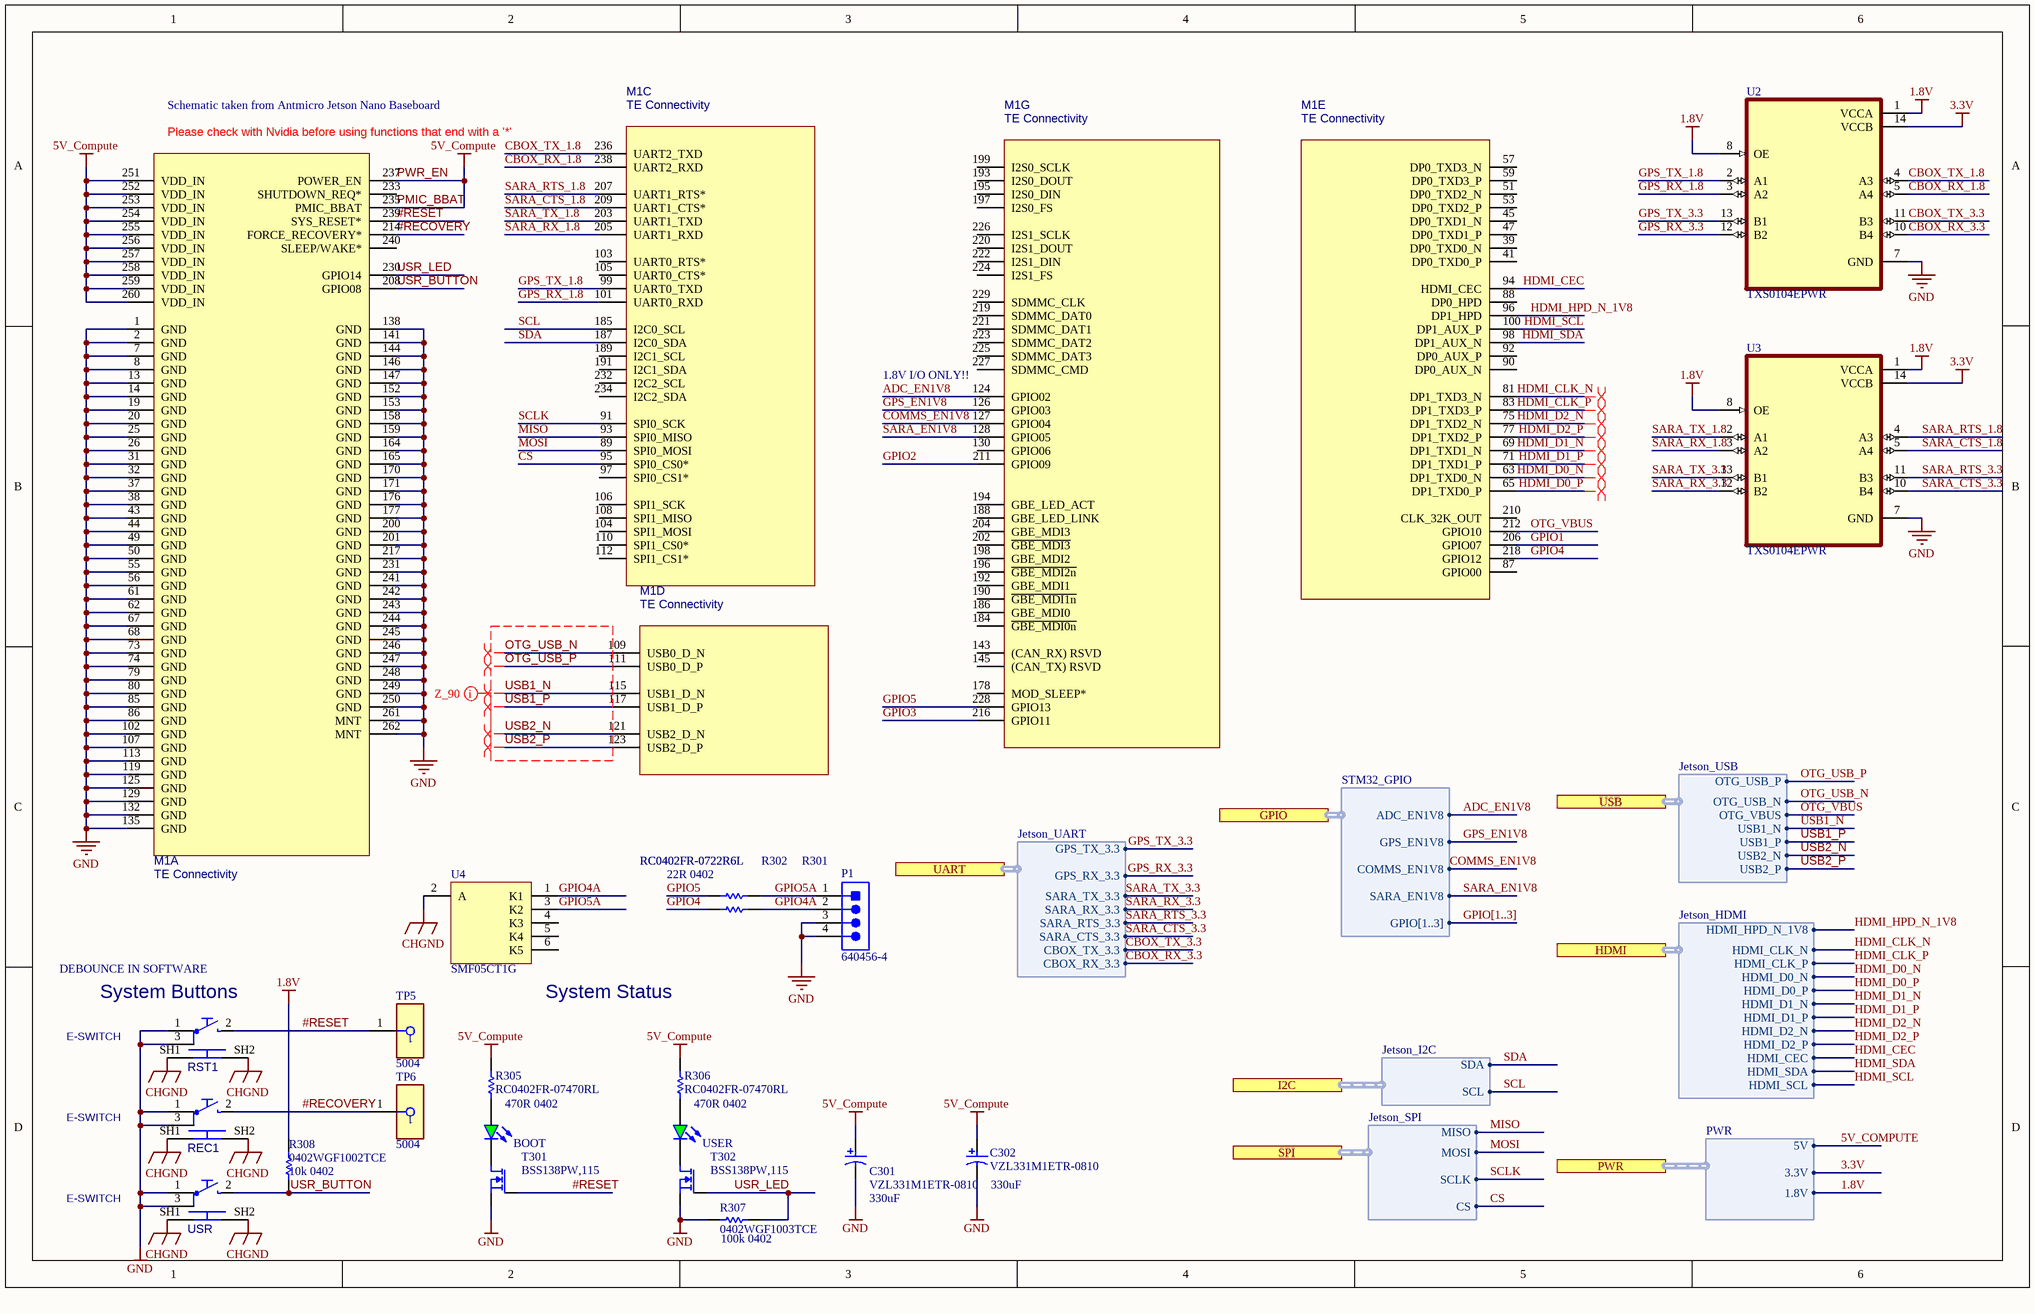
[diagram p4: 3_JetsonDRAMConnector.SchDoc]

### Parts
(Parts that share a designator on the sheet are numbered #1, #2 ... from top to bottom, then left to right.)
BOOT  APT1608SGC  [LED0603]  (value not drawn)
C301  VZL331M1ETR-0810  [NIC-CAPA2-8X10_V]
C302  VZL331M1ETR-0810  [NIC-CAPA2-8X10_V]
M1#1  Manufacturer: TE Connectivity  [jetson-nano-connector]  (hidden comment: 2309413-1)  (part E of 7)
M1#2  Manufacturer: TE Connectivity  [jetson-nano-connector]  (hidden comment: 2309413-1)  (parts A,C,D,G of 7)
P1#1  640456-4  [TECO-640456-4]
R301  RC0402FR-0722R6L  [0402]
R302  RC0402FR-0722R6L  [0402]
R305  RC0402FR-07470RL  [0402]
R306  RC0402FR-07470RL  [0402]
R307  0402WGF1003TCE  [0402]
R308  0402WGF1002TCE  [0402]
REC1  Manufacturer: E-SWITCH  [TL3340AF160QG]  (hidden comment: TL3340AF160QG)
RST1  Manufacturer: E-SWITCH  [TL3340AF160QG]  (hidden comment: TL3340AF160QG)
T301  BSS138PW,115  [SC70-3]
T302  BSS138PW,115  [SC70-3]
TP5  5004  [FP-5004-MFG]
TP6#1  5004  [FP-5004-MFG]
U2#1  TXS0104EPWR  [SOP65P640X120-14N]
U3#1  TXS0104EPWR  [SOP65P640X120-14N]
U4#1  SMF05CT1G  [ONSC-SC70-6-419B-02_W_V]
USER  APT1608SGC  [LED0603]  (value not drawn)
USR  Manufacturer: E-SWITCH  [TL3340AF160QG]  (hidden comment: TL3340AF160QG)

### Ports
GPIO (harness STM32_GPIO), HDMI (harness Jetson_HDMI), I2C (harness Jetson_I2C), PWR (harness PWR), SPI (harness Jetson_SPI), UART (harness Jetson_UART), USB (harness Jetson_USB)

### Harnesses
Jetson_UART: GPS_TX_3.3, GPS_RX_3.3, SARA_TX_3.3, SARA_RX_3.3, CBOX_TX_3.3, CBOX_RX_3.3, SARA_RTS_3.3, SARA_CTS_3.3
Jetson_I2C: SDA, SCL
Jetson_USB: OTG_USB_P, OTG_USB_N, USB1_N, USB1_P, USB2_N, USB2_P, OTG_VBUS
Jetson_SPI: MISO, MOSI, SCLK, CS
Jetson_HDMI: HDMI_HPD_N_1V8, HDMI_CLK_N, HDMI_CLK_P, HDMI_D0_N, HDMI_D0_P, HDMI_D1_N, HDMI_D1_P, HDMI_D2_N, HDMI_D2_P, HDMI_CEC, HDMI_SDA, HDMI_SCL
STM32_GPIO: ADC_EN1V8, GPS_EN1V8, COMMS_EN1V8, SARA_EN1V8, GPIO[1..3]
PWR: 5V, 3.3V, 1.8V

### Nets
1.8V: R308.1 U2#1.1(VCCA) U2#1.8(OE) U3#1.1(VCCA) U3#1.8(OE) ; port PWR.1.8V
3.3V: U2#1.14(VCCB) U3#1.14(VCCB) ; port PWR.3.3V
5V_COMPUTE: C301.1 C302.1 M1#2.235(PMIC_BBAT) M1#2.237(POWER_EN) M1#2.251(VDD_IN) M1#2.252(VDD_IN) M1#2.253(VDD_IN) M1#2.254(VDD_IN) M1#2.255(VDD_IN) M1#2.256(VDD_IN) M1#2.257(VDD_IN) M1#2.258(VDD_IN) M1#2.259(VDD_IN) M1#2.260(VDD_IN) R305.1 R306.1 ; port PWR.5V  [also labelled PMIC_BBAT, PWR_EN]
CHGND: REC1.SH1 REC1.SH2 RST1.SH1 RST1.SH2 U4#1.2(A) USR.SH1 USR.SH2
GND: C301.2 C302.2 M1#2.1(GND) M1#2.2(GND) M1#2.7(GND) M1#2.8(GND) M1#2.13(GND) M1#2.14(GND) M1#2.19(GND) M1#2.20(GND) M1#2.25(GND) M1#2.26(GND) M1#2.31(GND) M1#2.32(GND) M1#2.37(GND) M1#2.38(GND) M1#2.43(GND) M1#2.44(GND) M1#2.49(GND) M1#2.50(GND) M1#2.55(GND) M1#2.56(GND) M1#2.61(GND) M1#2.62(GND) M1#2.67(GND) M1#2.68(GND) M1#2.73(GND) M1#2.74(GND) M1#2.79(GND) M1#2.80(GND) M1#2.85(GND) M1#2.86(GND) M1#2.102(GND) M1#2.107(GND) M1#2.113(GND) M1#2.119(GND) M1#2.125(GND) M1#2.129(GND) M1#2.132(GND) M1#2.135(GND) M1#2.138(GND) M1#2.141(GND) M1#2.144(GND) M1#2.146(GND) M1#2.147(GND) M1#2.152(GND) M1#2.153(GND) M1#2.158(GND) M1#2.159(GND) M1#2.164(GND) M1#2.165(GND) M1#2.170(GND) M1#2.171(GND) M1#2.176(GND) M1#2.177(GND) M1#2.200(GND) M1#2.201(GND) M1#2.217(GND) M1#2.231(GND) M1#2.241(GND) M1#2.242(GND) M1#2.243(GND) M1#2.244(GND) M1#2.245(GND) M1#2.246(GND) M1#2.247(GND) M1#2.248(GND) M1#2.249(GND) M1#2.250(GND) M1#2.261(MNT) M1#2.262(MNT) P1#1.3 P1#1.4 R307.1 REC1.1 REC1.3 RST1.1 RST1.3 T301.2(S) T302.2(S) U2#1.7(GND) U3#1.7(GND) USR.1 USR.3
#RECOVERY: M1#2.214(FORCE_RECOVERY*) REC1.2 TP6#1.1
#RESET: M1#2.239(SYS_RESET*) RST1.2 T301.1(G) TP5.1
ADC_EN1V8: M1#2.124(GPIO02) ; port GPIO.ADC_EN1V8
CBOX_RX_1.8: M1#2.238(UART2_RXD) U2#1.5(A4)
CBOX_RX_3.3: U2#1.10(B4) ; port UART.CBOX_RX_3.3
CBOX_TX_1.8: M1#2.236(UART2_TXD) U2#1.4(A3)
CBOX_TX_3.3: U2#1.11(B3) ; port UART.CBOX_TX_3.3
COMMS_EN1V8: M1#2.127(GPIO04) ; port GPIO.COMMS_EN1V8
CS: M1#2.95(SPI0_CS0*) ; port SPI.CS
GPIO1: M1#1.206(GPIO07)
GPIO2: M1#2.211(GPIO09)
GPIO3: M1#2.216(GPIO11)
GPIO4: M1#1.218(GPIO12) R302.1
GPIO4A: P1#1.2 R302.2 U4#1.1(K1)
GPIO5: M1#2.228(GPIO13) R301.1
GPIO5A: P1#1.1 R301.2 U4#1.3(K2)
GPS_EN1V8: M1#2.126(GPIO03) ; port GPIO.GPS_EN1V8
GPS_RX_1.8: M1#2.101(UART0_RXD) U2#1.3(A2)
GPS_RX_3.3: U2#1.12(B2) ; port UART.GPS_RX_3.3
GPS_TX_1.8: M1#2.99(UART0_TXD) U2#1.2(A1)
GPS_TX_3.3: U2#1.13(B1) ; port UART.GPS_TX_3.3
HDMI_CEC: M1#1.94(HDMI_CEC) ; port HDMI.HDMI_CEC
HDMI_CLK_N: M1#1.81(DP1_TXD3_N) ; port HDMI.HDMI_CLK_N
HDMI_CLK_P: M1#1.83(DP1_TXD3_P) ; port HDMI.HDMI_CLK_P
HDMI_D0_N: M1#1.63(DP1_TXD0_N) ; port HDMI.HDMI_D0_N
HDMI_D0_P: M1#1.65(DP1_TXD0_P) ; port HDMI.HDMI_D0_P
HDMI_D1_N: M1#1.69(DP1_TXD1_N) ; port HDMI.HDMI_D1_N
HDMI_D1_P: M1#1.71(DP1_TXD1_P) ; port HDMI.HDMI_D1_P
HDMI_D2_N: M1#1.75(DP1_TXD2_N) ; port HDMI.HDMI_D2_N
HDMI_D2_P: M1#1.77(DP1_TXD2_P) ; port HDMI.HDMI_D2_P
HDMI_HPD_N_1V8: M1#1.96(DP1_HPD) ; port HDMI.HDMI_HPD_N_1V8
HDMI_SCL: M1#1.100(DP1_AUX_P) ; port HDMI.HDMI_SCL
HDMI_SDA: M1#1.98(DP1_AUX_N) ; port HDMI.HDMI_SDA
MISO: M1#2.93(SPI0_MISO) ; port SPI.MISO
MOSI: M1#2.89(SPI0_MOSI) ; port SPI.MOSI
OTG_USB_N: M1#2.109(USB0_D_N) ; port USB.OTG_USB_N
OTG_USB_P: M1#2.111(USB0_D_P) ; port USB.OTG_USB_P
OTG_VBUS: M1#1.212(GPIO10) ; port USB.OTG_VBUS
SARA_CTS_1.8: M1#2.209(UART1_CTS*) U3#1.5(A4)
SARA_CTS_3.3: U3#1.10(B4) ; port UART.SARA_CTS_3.3
SARA_EN1V8: M1#2.128(GPIO05) ; port GPIO.SARA_EN1V8
SARA_RTS_1.8: M1#2.207(UART1_RTS*) U3#1.4(A3)
SARA_RTS_3.3: U3#1.11(B3) ; port UART.SARA_RTS_3.3
SARA_RX_1.8: M1#2.205(UART1_RXD) U3#1.3(A2)
SARA_RX_3.3: U3#1.12(B2) ; port UART.SARA_RX_3.3
SARA_TX_1.8: M1#2.203(UART1_TXD) U3#1.2(A1)
SARA_TX_3.3: U3#1.13(B1) ; port UART.SARA_TX_3.3
SCL: M1#2.185(I2C0_SCL) ; port I2C.SCL
SCLK: M1#2.91(SPI0_SCK) ; port SPI.SCLK
SDA: M1#2.187(I2C0_SDA) ; port I2C.SDA
USB1_N: M1#2.115(USB1_D_N) ; port USB.USB1_N
USB1_P: M1#2.117(USB1_D_P) ; port USB.USB1_P
USB2_N: M1#2.121(USB2_D_N) ; port USB.USB2_N
USB2_P: M1#2.123(USB2_D_P) ; port USB.USB2_P
USR_BUTTON: M1#2.208(GPIO08) R308.2 USR.2
USR_LED: M1#2.230(GPIO14) R307.2 T302.1(G)
NetBOOT_A: BOOT.A R305.2
NetBOOT_K: BOOT.K T301.3(D)
NetR306_2: R306.2 USER.A
NetT302_3: T302.3(D) USER.K

Not connected (* = marked no-connect by the designer): M1#1 39(DP0_TXD0_N) 41(DP0_TXD0_P) 45(DP0_TXD1_N) 47(DP0_TXD1_P) 51(DP0_TXD2_N) 53(DP0_TXD2_P) 57(DP0_TXD3_N) 59(DP0_TXD3_P) 87(GPIO00) 88(DP0_HPD) 90(DP0_AUX_N) 92(DP0_AUX_P) 210(CLK_32K_OUT); M1#2 97(SPI0_CS1*) 103(UART0_RTS*) 104(SPI1_MOSI) 105(UART0_CTS*) 106(SPI1_SCK) 108(SPI1_MISO) 110(SPI1_CS0*) 112(SPI1_CS1*) 130(GPIO06) 143((CAN_RX)_RSVD) 145((CAN_TX)_RSVD) 178(MOD_SLEEP*) 184(~{GBE_MDI0n}) 186(GBE_MDI0) 188(GBE_LED_LINK) 189(I2C1_SCL) 190(~{GBE_MDI1n}) 191(I2C1_SDA) 192(GBE_MDI1) 193(I2S0_DOUT) 194(GBE_LED_ACT) 195(I2S0_DIN) 196(~{GBE_MDI2n}) 197(I2S0_FS) 198(GBE_MDI2) 199(I2S0_SCLK) 202(~{GBE_MDI3}) 204(GBE_MDI3) 219(SDMMC_DAT0) 220(I2S1_DOUT) 221(SDMMC_DAT1) 222(I2S1_DIN) 223(SDMMC_DAT2) 224(I2S1_FS) 225(SDMMC_DAT3) 226(I2S1_SCLK) 227(SDMMC_CMD) 229(SDMMC_CLK) 232(I2C2_SCL) 233(SHUTDOWN_REQ*) 234(I2C2_SDA) 240(SLEEP/WAKE*); U4#1 4(K3) 5(K4) 6(K5)

### Buses and harness runs
bus GPIO[1..3]

### Layout directives
net class Z_90: OTG_USB_N, OTG_USB_P, USB1_N, USB1_P, USB2_N, USB2_P
differential pair: HDMI_CLK_N, HDMI_CLK_P, HDMI_D0_N, HDMI_D0_P, HDMI_D1_N, HDMI_D1_P, HDMI_D2_N, HDMI_D2_P, OTG_USB_N, OTG_USB_P, USB1_N, USB1_P, USB2_N, USB2_P

### Notes on the sheet
- Schematic taken from Antmicro Jetson Nano Baseboard
- (near M1#2) 1.8V I/O ONLY!!
- (near R301) 22R 0402
- DEBOUNCE IN SOFTWARE
- (near RST1) System Buttons
- (near U4#1) System Status
- 470R 0402
- (near R308) 10k 0402
- (near R307) 100k 0402
- (near C301) 330uF
- (near C302) 330uF
- (in symbol jetson-nano-new-release, part A) Please check with Nvidia before using functions that end with a '*'

### Library data of the parts
BOOT USER = LED: LED Green 0603 case; PartNumber: LED_G; Manufacturer: KINGBRIGHT; Value: APT1608SGC; MPN: APT1608SGC
C301 C302 = CMP-0687-00072-1: Aluminum Electrolytic Capacitor, UD Series, Low Impedance, 330 uF, 10 V, + / - 20%, -55 to 105 degC, Chip Type, 8 x 10 mm D x L, Pb-Free, Reel; PartNumber: UUD1A331MNL1GS; Manufacturer: Nichicon; Rated Capacitance: 330 uF; Packing: Dia382mm Reel; Tolerance Rated Capacitance: -20 to 20%; Endurance Time: 5000 h; Rated Ripple Current (at 100kHz): 450 mA; Rated Voltage: 10 V; Impedance: 0.17 Ohm; ComponentLink1URL: http://www.nichicon.co.jp/; DatasheetVersion: 08/2012; ComponentLink2URL: http://products.nichicon.co.jp/en/pdf/XJA043/e-ud.pdf; Diameter: 8 mm; ComponentLink1Description: Manufacturer URL; PackageDescription: 2-Pin Surface Mount Device, Diameter 8 mm, Height 10 mm, Pitch 6.5 mm; Mounting Technology: Surface Mount; ComponentLink3URL: http://products.nichicon.co.jp/en/pdf/XJA043/e-ud.pdf; ComponentLink3Description: Package Specification; Length: 10 mm; ComponentLink2Description: Datasheet; PackageReference: CAPAE-D8H10; RoHS: TRUE
M1#1 M1#2 = jetson-nano-new-release: PartNumber: 2309413-1; Value: 2309413-1; MPN: 2309413-1
P1#1 = CMP-2000-05419-1: Male Header, Pitch 2.54 mm, 1 x 4 Position, Height 10.03 mm, Tail Length 3.56 mm, RoHS, Bulk; Manufacturer: TE Connectivity; Material, Housing: Polyester; Primary Type: InterconnectSystem; Mount Angle: Vertical; Color, Housing: White; Current, Rating: 5 / A; Agency Approvals: CSA,UL; Contact Termination Area Plating: Tin; Temperature, Operating: -55to+105 / degC; Standards: RoHSCompliant,ELVCompliant,UL94V-0; Number of Positions: 4; Brand/Series: MTA-100Series; Angle: Straight; Pin Spacing: 0.1 / "; Material, Contact: CopperAlloy; Connector Type: MTA-100; Special Features: Pinstrip; Mounting Hole Size: 0.04 / "; Contact Centerline Spacing: 0.100 / in.; Voltage, Rating: 250 / V; Manufacturer URL: http://www.te.com/; Length, Pin: 0.14 / "; Length, Overall: 0.4 / "; Color: White; Flammability Rating: UL94V-0; Mounting Type: PCMount; Termination: Solder; Datasheet URL: https://datasheet.ciiva.com/16286/eng-ds-82056-mta-0608-16286228.pdf; Number of Contacts: 4; Contact Shape: Square; Contact Mating Area Plating: Tin; Length, Terminal Post: 0.14 / in.; Size, Post: 0.025 / in.; Contact Plating: Tin; Type: PCBPlug; Datasheet Version: Dec-14; Number of Rows: 1
R301 R302 = Res1: 22R 0402; Published: 8-Jun-2000; LatestRevisionDate: 17-Jul-2002; LatestRevisionNote: Re-released for DXP Platform.; PackageReference: AXIAL-0.3; Publisher: Altium Limited; PackageDescription: Axial Device, Thru-Hole; 2 Leads; 0.3 in Pin Spacing; Case Code (Imperial): 0402
R305 R306 = Res1: 470R 0402; Published: 8-Jun-2000; LatestRevisionDate: 17-Jul-2002; LatestRevisionNote: Re-released for DXP Platform.; PackageReference: AXIAL-0.3; Publisher: Altium Limited; PackageDescription: Axial Device, Thru-Hole; 2 Leads; 0.3 in Pin Spacing; Case Code (Imperial): 0402
R307 = Res1: 100k 0402; Published: 8-Jun-2000; LatestRevisionDate: 17-Jul-2002; LatestRevisionNote: Re-released for DXP Platform.; PackageReference: AXIAL-0.3; Publisher: Altium Limited; PackageDescription: Axial Device, Thru-Hole; 2 Leads; 0.3 in Pin Spacing; Case Code (Imperial): 0402
R308 = Res1: 10k 0402; Published: 8-Jun-2000; LatestRevisionDate: 17-Jul-2002; LatestRevisionNote: Re-released for DXP Platform.; PackageReference: AXIAL-0.3; Publisher: Altium Limited; PackageDescription: Axial Device, Thru-Hole; 2 Leads; 0.3 in Pin Spacing; Case Code (Imperial): 0402
REC1 RST1 USR = TL3340AF160QG: E-SWITCH  TL3340AF160QG  SWITCH, TACTILE SPST 50mA, SMD GULL WING; Value: TL3340AF160QG; PartNumber: TL3340AF160QG; MPN: TL3340AF160QG
T301 T302 = NMOS: as T401 on sheet 4_PeripheralsV2; Value: BSS138PW,115; PartNumber: BSS138PW,115; MPN: BSS138PW,115
TP5 TP6#1 = CMP-2000-05575-2: as TP8#1 on sheet 200PinConnector; Device Class L1: Connectors; Manufacturer Part Number: 5004; Digikey Description: PC TEST POINT MINIATURE YELLOW; ComponentLink2URL: https://www.keyelco.com/product-pdf.cfm?p=1313; Lead Free: Yes; ComponentLink2Description: Datasheet; Category: Conn; Height: 4.72mm; Octopart: https://octopart.com/5004-keystone-28591; Mouser Description: TEST POINT PC MINI .040"D YELLOW; Device Class L3: unset; Contact Material: Silver; Package: 5004; Automotive: No; Device Class L2: unset; RoHS: TRUE
U2#1 U3#1 = TXS0104EPWR: 4-Bit Bidirectional Voltage-Level Shifter for Open-Drain and Push-Pull Applications 14-TSSOP -40 to 85; MF: Texas Instruments; Availability: Unavailable; Price: None; MP: TXS0104EPWR; Package: TSSOP-14 Texas Instruments; SnapEDA_Link: https://www.snapeda.com/parts/TXS0104EPWR/Texas%20Instruments/view-part/134341/?ref=snap; Value: *; Texas_Instruments-Purchase-URL: https://snapeda.com/shop?store=Texas+Instruments&id=134341
U4#1 = CMP-1061-00155-1: as U7 on sheet 200PinConnector; PackageDescription: 6-Pin Small Outline Transistor, Body 2 x 1.25 mm, Pitch 0.65 mm; PackageReference: SC70-6-419B-02_W; ComponentLink2Description: Datasheet; Mounting Technology: Surface Mount; Packing: Tape and Reel; DatasheetVersion: Rev. 4; ComponentLink1Description: Manufacturer URL; ComponentLink2URL: http://www.onsemi.com/pub_link/Collateral/SMF05C-D.PDF; ComponentLink3Description: Package Specification; ComponentLink1URL: http://www.onsemi.com/; ComponentLink3URL: http://www.onsemi.com/pub_link/Collateral/SMF05C-D.PDF; PackageVersion: Rev. W; PartNumber: SMF05CT1G; RoHS: Pb-Free